# Altium schematic sheet 3_PSU.SchDoc
size A4; SheetNumber: 3; SheetTotal: 3
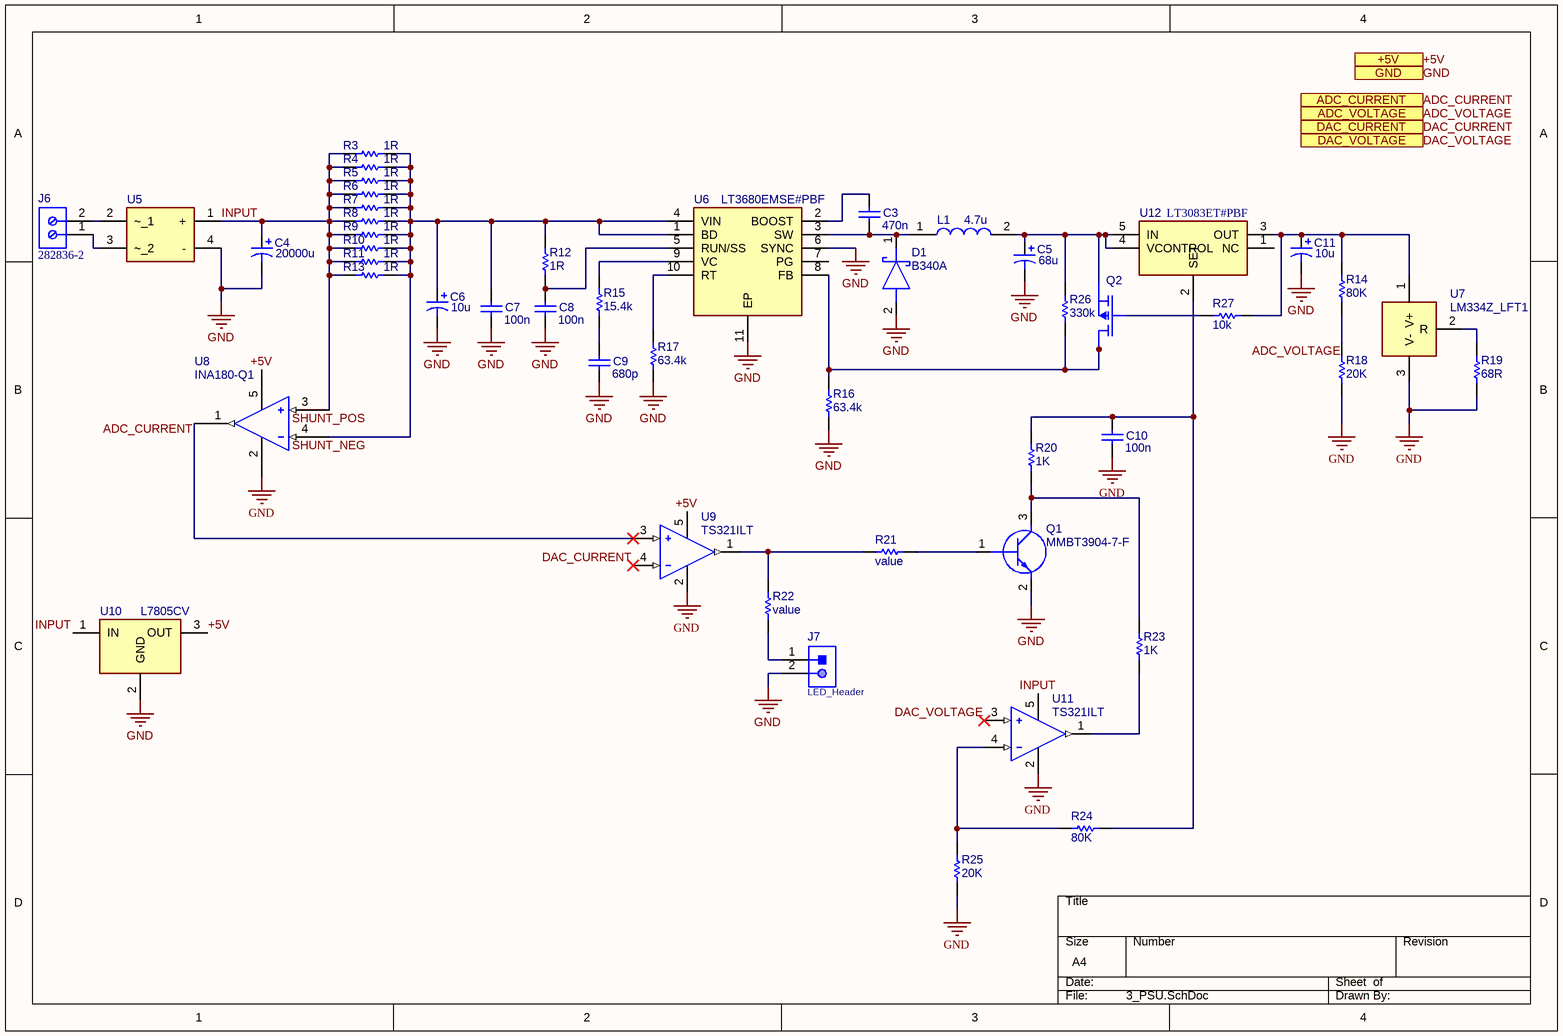
[diagram p0: 3_PSU.SchDoc]

## Parts
C3  value 470n  [6-0805_M]  (hidden comment: Capacitor)
C4  value 20000u  (hidden comment: Cap Pol1)
C5  value 68u  (hidden comment: Cap Pol1)
C6  value 10u  (hidden comment: Cap Pol1)
C7  value 100n  [6-0805_M]  (hidden comment: Capacitor)
C8  value 100n  [6-0805_M]  (hidden comment: Capacitor)
C9  value 680p  [6-0805_M]  (hidden comment: Capacitor)
C10  value 100n  [6-0805_M]  (hidden comment: Capacitor)
C11  value 10u  (hidden comment: Cap Pol1)
D1  B340A  [DIOM5127X229N]
J6  282836-2  [TECO-282836-2_V]
J7  LED_Header  [61300211121]
L1  4.7u  [VLS5045EX330M]
Q1  MMBT3904-7-F  [SOT96P240X110-3N]
Q2  ZVP4525GTA  [SOT230P700X180-4N]  (value not drawn)
R3  value 1R  [6-0805_M]  (hidden comment: Resistor)
R4  value 1R  [6-0805_M]  (hidden comment: Resistor)
R5  value 1R  [6-0805_M]  (hidden comment: Resistor)
R6  value 1R  [6-0805_M]  (hidden comment: Resistor)
R7  value 1R  [6-0805_M]  (hidden comment: Resistor)
R8  value 1R  [6-0805_M]  (hidden comment: Resistor)
R9  value 1R  [6-0805_M]  (hidden comment: Resistor)
R10  value 1R  [6-0805_M]  (hidden comment: Resistor)
R11  value 1R  [6-0805_M]  (hidden comment: Resistor)
R12  value 1R  [6-0805_M]  (hidden comment: Resistor)
R13  value 1R  [6-0805_M]  (hidden comment: Resistor)
R14  value 80K  [6-0805_M]  (hidden comment: Resistor)
R15  value 15.4k  [6-0805_M]  (hidden comment: Resistor)
R16  value 63.4k  [6-0805_M]  (hidden comment: Resistor)
R17  value 63.4k  [6-0805_M]  (hidden comment: Resistor)
R18  value 20K  [6-0805_M]  (hidden comment: Resistor)
R19  value 68R  [6-0805_M]  (hidden comment: Resistor)
R20  value 1K  [6-0805_M]  (hidden comment: Resistor)
R21  Resistor  [6-0805_M]  (value not drawn)
R22  Resistor  [6-0805_M]  (value not drawn)
R23  value 1K  [6-0805_M]  (hidden comment: Resistor)
R24  value 80K  [6-0805_M]  (hidden comment: Resistor)
R25  value 20K  [6-0805_M]  (hidden comment: Resistor)
R26  value 330k  [6-0805_M]  (hidden comment: Resistor)
R27  value 10k  [6-0805_M]  (hidden comment: Resistor)
U5  GBU1010_T0_00601  [GBU1010_T0_00601]  (value not drawn)
U6  LT3680EMSE#PBF  [SOP50P490X110-11N]
U7  LM334Z_LFT1  [LP0003A]
U8  INA180-Q1  [SOT95P280X145-5N]
U9  TS321ILT  [SOT95P280X145-5N]
U10  L7805CV  [TO255P460X1020X2008-3P]
U11  TS321ILT  [SOT95P280X145-5N]
U12  LT3083ET#PBF  [TO170P457X1022X2306-5P]

## Ports
+5V (see 1_Controller[4A], 2_DAC_ADC[4A]), ADC_CURRENT (see 2_DAC_ADC[4A]), ADC_VOLTAGE (see 2_DAC_ADC[4A]), DAC_CURRENT (see 2_DAC_ADC[4A]), DAC_VOLTAGE (see 2_DAC_ADC[4A]), GND (see 1_Controller[4A], 2_DAC_ADC[4A])

## Nets
GND: C4.2 C5.2 C6.2 C7.1 C8.1 C9.1 C10.1 C11.2 D1.2(A) J7.2 Q1.2(E) R16.1 R17.1 R18.1 R19.1 R25.1 U5.4(-) U6.6(SYNC) U6.11(EP) U7.3(V-) U8.2(GND) U9.2(VCC-) U10.2(GND) U11.2(VCC-) ; port GND
+5V: U8.5(VS) U9.5(VCC+) U10.3(OUT) ; port +5V
ADC_CURRENT: U8.1(OUT) U9.3(NON-INVERTING_INPUT) ; port ADC_CURRENT
ADC_VOLTAGE: R14.1 R18.2 ; port ADC_VOLTAGE
DAC_CURRENT: U9.4(INVERTING_INPUT) ; port DAC_CURRENT
DAC_VOLTAGE: U11.3(NON-INVERTING_INPUT) ; port DAC_VOLTAGE
INPUT: C4.1 R3.1 R4.1 R5.1 R6.1 R7.1 R8.1 R9.1 R10.1 R11.1 R13.1 U5.1(+) U8.3(IN+) U10.1(IN) U11.5(VCC+)  [also labelled SHUNT_POS]
SHUNT_NEG: C6.1 C7.2 R3.2 R4.2 R5.2 R6.2 R7.2 R8.2 R9.2 R10.2 R11.2 R12.2 R13.2 U6.1(BD) U6.4(VIN) U8.4(IN-)
NetC3_1: C3.1 D1.1(K) L1.1 U6.3(SW)
NetC3_2: C3.2 U6.2(BOOST)
NetC5_1: C5.1 L1.2 Q2.3(S) R26.2 U12.4(VCONTROL) U12.5(IN)
NetC8_2: C8.2 R12.1 U6.5(RUN/SS)
NetC9_2: C9.2 R15.1
NetC10_2: C10.2 R20.2 R24.1 U12.2(SET)
NetC11_1: C11.1 R14.2 R27.1 U7.1(V+) U12.3(OUT)
NetJ6_1: J6.1 U5.3(~_2)
NetJ6_2: J6.2 U5.2(~_1)
NetJ7_1: J7.1 R22.1
NetQ1_1: Q1.1(B) R21.2
NetQ1_3: Q1.3(C) R20.1 R23.2
NetQ2_1: Q2.1(G) R27.2
NetQ2_2: Q2.2(D_1) Q2.4(D_2) R16.2 R26.1 U6.8(FB)
NetR15_2: R15.2 U6.9(VC)
NetR17_2: R17.2 U6.10(RT)
NetR19_2: R19.2 U7.2(R)
NetR21_1: R21.1 R22.2 U9.1(OUTPUT)
NetR23_1: R23.1 U11.1(OUTPUT)
NetR24_2: R24.2 R25.2 U11.4(INVERTING_INPUT)

Not connected (* = marked no-connect by the designer): U6 7(PG); U12 1(NC)

## Library data of the parts
C3 C7-C10 = Capacitor: SimulationGenericComponent: True
C4-C6 C11 = Cap Pol1: Polarized Capacitor (Radial); Published: 8-Jun-2000; LatestRevisionDate: 17-Jul-2002; LatestRevisionNote: Re-released for DXP Platform.; PackageReference: RB7.6-15; Publisher: Altium Limited; PackageDescription: Polarized Capacitor (Radial); 2 Leads
D1 = B340A-E3_61T: Diode; Manufacturer_Name: Vishay; Manufacturer_Part_Number: B340A-E3/61T; Datasheet Link: https://ms.componentsearchengine.com/Datasheets/2/B340A-E3_61T.pdf; Height: 2.29mm; Mouser Part Number: 625-BD340A-E3/61T; Mouser Price/Stock: https://www.mouser.co.uk/ProductDetail/Vishay-General-Semiconductor/B340A-E3-61T?qs=tdXsjSi%2FIMY4I2dGLbnpzg%3D%3D; Arrow Part Number: B340A-E3/61T; Arrow Price/Stock: https://www.arrow.com/en/products/b340a-e361t/vishay?region=nac
J6 = CMP-1684-00017-1: Female Header, Pitch 5 mm, 1 x 2 Position, Height 10 mm, Tail Length 3.5 mm, Rohs, Bulk; Manufacturer: TE Connectivity; Wire Gauge: 16-30AWG; Product Training Modules: Wire-to-BoardEurostyleTerminalBlocks; Clamp Material - Plating: Brass-NickelPlated; Voltage: 300V; Mating Orientation: HorizontalwithBoard; Current: 13.5A; Pitch: 0.197"(5.00mm); Screw Thread: M3; 3D Model: 282836-2.pdf; Other Names: 5ULV-02B / A98076; Dynamic Catalog: BuchananSeries; Number of Levels: 1; Torque - Screw: 0.68Nm(6Lb-In); Featured Product: EurostyleTerminalBlockConnectors; Positions Per Level: 2; Wire Termination: Screw-RisingCageClamp; Datasheet URL: http://www.te.com.cn/commerce/DocumentDelivery/DDEController?Action=showdoc&DocId=Catalog+Section%7F1308389_EUROSTYLE_TERMINAL_BLOCKS%7F0607%7Fpdf%7FEnglish%7FENG_CS_1308389_EUROSTYLE_TERMINAL_BLOCKS_0607.pdf%7F282836-2; Color: Green; Family: TerminalBlocks-WiretoBoard; RoHS Information: 282836-2StatementofCompliance; Standard Package: 300; Contact Material - Plating: Brass-TinPlated; Manufacturer URL: http://www.te.com; Housing Material: Polyamide(PA66),Nylon6/6; Features: Interlocking(Side); Package Description: Female Header, Pitch 5 mm, 1 x 2 Position, Height 10 mm, Tail Length 3.5 mm; Mounting Type: ThroughHole; Package Reference: THD; Packaging: Bulk; Series: Buchanan; Category: Connectors,Interconnects; Screw Material - Plating: Brass-NickelPlated
J7 = CMP-1712-00002-4: THT Vertical Pin Header WR-PHD, Pitch 2.54 mm, Single Row, 2 pins; Manufacturer: Wurth Elektronik; Rated Current: 3A; Gender: Male; Withstanding Voltage: 500VAC; Working Voltage: 250VAC; Pitch: 2.54mm; Contact Resistance: 20mOhm; Pin Number: 2; Mounting Technology: THT; Orientation: Vertical; Operating Temperature: -40to105degC; Packaging: Bag; Publisher: WurthElektronik; Datasheet URL: https://katalog.we-online.de/em/datasheet/6130xx11121.pdf; Manufacturer URL: http://www.we-online.de; Row Number: Single; Package Reference: 61300211121; Part Number: 61300211121
L1 = VLS5045EX-4R7M-H: Manufacturer_Name: TDK; Datasheet Link: https://product.tdk.com/system/files/dam/doc/product/inductor/inductor/smd/catalog/inductor_automotive_power_vls5045ex-h_en.pdf; Height: 4mm; Manufacturer_Part_Number: VLS5045EX-4R7M-H; Mouser Part Number: 810-VLS5045EX-4R7M-H; Mouser Price/Stock: https://www.mouser.co.uk/ProductDetail/TDK/VLS5045EX-4R7M-H?qs=EBDBlbfErPwFg%2FOwn47Q1A%3D%3D; Arrow Part Number: VLS5045EX-4R7M-H; Arrow Price/Stock: https://www.arrow.com/en/products/vls5045ex-4r7m-h/tdk?region=nac
Q1 = MMBT3904-7-F: Transistor BJT NPN; Manufacturer_Name: Diodes Inc.; Datasheet Link: https://www.arrow.com/en/products/mmbt3904-7-f/diodes-incorporated; Height: 1.1mm; Manufacturer_Part_Number: MMBT3904-7-F; Mouser Part Number: 621-MMBT3904-F; Mouser Price/Stock: https://www.mouser.co.uk/ProductDetail/Diodes-Incorporated/MMBT3904-7-F?qs=7F%2FY8wl6X3H3eL7tHVWSBQ%3D%3D; Arrow Part Number: MMBT3904-7-F; Arrow Price/Stock: https://www.arrow.com/en/products/mmbt3904-7-f/diodes-incorporated?region=nac
Q2 = ZVP4525GTA: MOSFET (P-Channel); Manufacturer_Name: Diodes Inc.; Description: Diodes Inc ZVP4525GTA P-channel MOSFET Transistor; Datasheet Link: https://www.diodes.com/assets/Datasheets/ZVP4525G.pdf; Height: 1.8mm; Manufacturer_Part_Number: ZVP4525GTA; Mouser Part Number: 522-ZVP4525GTA; Mouser Price/Stock: https://www.mouser.co.uk/ProductDetail/Diodes-Incorporated/ZVP4525GTA?qs=GedFDFLaBXFR8NEzssRbSQ%3D%3D; Arrow Part Number: ZVP4525GTA; Arrow Price/Stock: https://www.arrow.com/en/products/zvp4525gta/diodes-incorporated?region=nac
R3-R27 = Resistor: Shunt; TC1: 0; SimulationGenericComponent: True; TC2: 0
  R21 R22: Value: value
U5 = GBU1010_T0_00601: Bridge Rectifier; Manufacturer_Name: PANJIT; Datasheet Link: https://www.panjit.com.tw/upload/datasheet/GBU1010.pdf; Height: 21.55mm; Manufacturer_Part_Number: GBU1010_T0_00601; Mouser Part Number: 241-GBU1010_T0_00601; Mouser Price/Stock: https://www.mouser.co.uk/ProductDetail/Panjit/GBU1010_T0_00601?qs=Znm5pLBrcAI2lNvio7iUfQ%3D%3D
U6 = LT3680EMSE#PBF: Integrated Circuit; Manufacturer_Name: Analog Devices; Datasheet Link: http://cds.linear.com/docs/en/datasheet/3680fb.pdf; Height: 1.1mm; Manufacturer_Part_Number: LT3680EMSE#PBF; Mouser Part Number: 584-LT3680EMSE#PBF; Mouser Price/Stock: https://www.mouser.co.uk/ProductDetail/Analog-Devices/LT3680EMSEPBF?qs=hVkxg5c3xu84NF9L1FMYWA%3D%3D; Arrow Part Number: LT3680EMSE#PBF; Arrow Price/Stock: https://www.arrow.com/en/products/lt3680emsepbf/analog-devices?region=nac
U7 = LM334Z_LFT1: Integrated Circuit; Manufacturer_Name: Texas Instruments; Manufacturer_Part_Number: LM334Z/LFT1; Datasheet Link: http://www.ti.com/lit/ds/symlink/lm134.pdf; Mouser Part Number: 926-LM334Z/LFT1; Mouser Price/Stock: https://www.mouser.co.uk/ProductDetail/Texas-Instruments/LM334Z-LFT1?qs=X1J7HmVL2ZHhZPl3u1Nn6g%3D%3D; Arrow Part Number: LM334Z/LFT1; Arrow Price/Stock: https://www.arrow.com/en/products/lm334zlft1/texas-instruments?region=nac
U8 = INA180-Q1: Current Sense Amplifier
U9 U11 = TS321ILT: Integrated Circuit; Manufacturer_Name: STMicroelectronics; Datasheet Link: http://www.st.com/st-web-ui/static/active/en/resource/technical/document/datasheet/CD00001647.pdf; Height: 1.45mm; Manufacturer_Part_Number: TS321ILT; Mouser Part Number: 511-TS321IL; Mouser Price/Stock: https://www.mouser.co.uk/ProductDetail/STMicroelectronics/TS321ILT?qs=AYLkW%2FmgjI3DImBJVY6kBw%3D%3D; Arrow Part Number: TS321ILT; Arrow Price/Stock: https://www.arrow.com/en/products/ts321ilt/stmicroelectronics?region=europe
U10 = L7805CV: Integrated Circuit; Manufacturer_Name: STMicroelectronics; Datasheet Link: http://www.st.com/web/en/resource/technical/document/datasheet/CD00000444.pdf; Height: 4.6mm; Manufacturer_Part_Number: L7805CV; Mouser Part Number: 511-L7805CV; Mouser Price/Stock: https://www.mouser.co.uk/ProductDetail/STMicroelectronics/L7805CV?qs=9NrABl3fj%2FqplZAHiYUxWg%3D%3D; Arrow Part Number: L7805CV; Arrow Price/Stock: https://www.arrow.com/en/products/l7805cv/stmicroelectronics?region=europe
U12 = LT3083ET#PBF: Integrated Circuit; Manufacturer_Name: Analog Devices; Description: IC REG LDO ADJ 3A TO220-5; Datasheet Link: http://www.linear.com/docs/30239; Height: 4.572mm; Manufacturer_Part_Number: LT3083ET#PBF; Mouser Part Number: 584-LT3083ET#PBF; Mouser Price/Stock: https://www.mouser.co.uk/ProductDetail/Analog-Devices/LT3083ETPBF?qs=hVkxg5c3xu%252BEQibxnmC0QQ%3D%3D; Arrow Part Number: LT3083ET#PBF; Arrow Price/Stock: https://www.arrow.com/en/products/lt3083etpbf/linear-technology